# Altium project stm32-synthesizer.PrjPcb
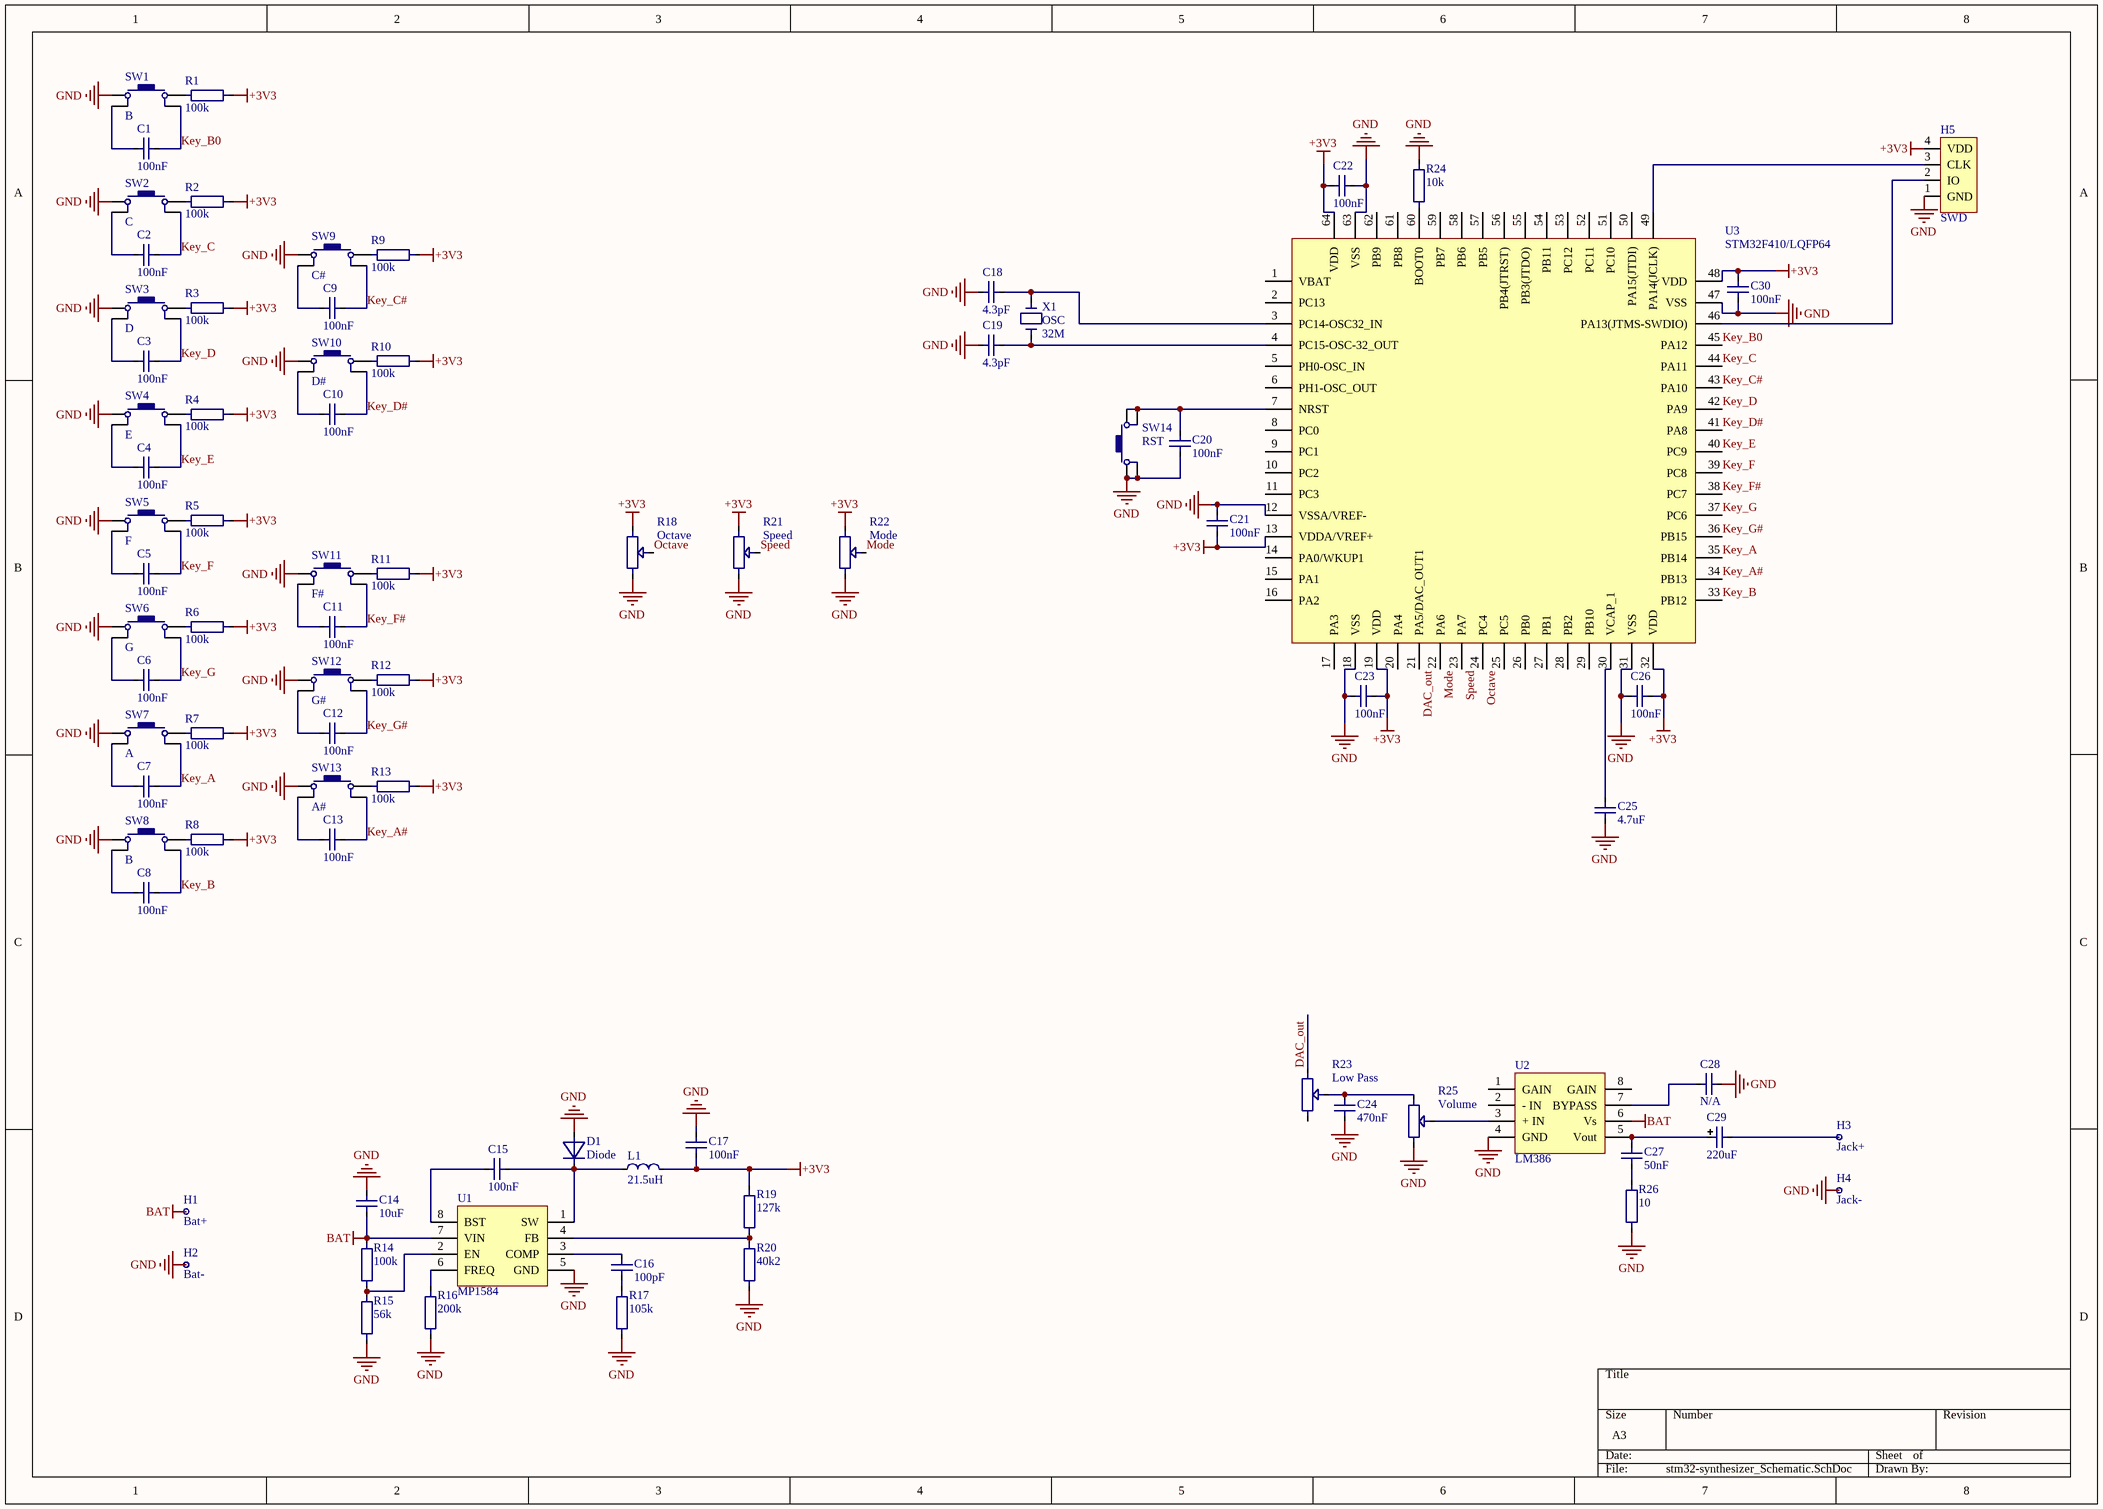
[diagram p0: stm32-synthesizer_Schematic.SchDoc]
1 sheet, 81 parts. Net scope: global (net labels, ports and power ports of the same name join across sheets).
Board file: stm32-synthesizer_Board.PcbDoc

## Sheet stm32-synthesizer_Schematic.SchDoc
size A3

### Parts
C1  100nF  [CRCW0805]
C2  100nF  [CRCW0805]
C3  100nF  [CRCW0805]
C4  100nF  [CRCW0805]
C5  100nF  [CRCW0805]
C6  100nF  [CRCW0805]
C7  100nF  [CRCW0805]
C8  100nF  [CRCW0805]
C9  100nF  [CRCW0805]
C10  100nF  [CRCW0805]
C11  100nF  [CRCW0805]
C12  100nF  [CRCW0805]
C13  100nF  [CRCW0805]
C14  10uF  [CRCW0805]
C15  100nF  [GRM188]
C16  100pF  [CRCW0805]
C17  100nF  [GRM188]
C18  4.3pF  [CRCW0805]
C19  4.3pF  [CRCW0805]
C20  100nF  [CRCW0805]
C21  100nF  [CRCW0805]
C22  100nF  [CRCW0805]
C23  100nF  [CRCW0805]
C24  470nF  [CRCW0805]
C25  4.7uF  [CRCW0805]
C26  100nF  [CRCW0805]
C27  50nF  [CRCW0805]
C28  N/A  [CRCW0805]
C29  220uF  [CAPAE6766X81M]
C30  100nF  [CRCW0805]
D1  Diode  [DIODES-INCORPORATED_1N5819]
H1  Bat+  [Hole 1mm]
H2  Bat-  [Hole 1mm]
H3  Jack+  [Hole 1mm]
H4  Jack-  [Hole 1mm]
H5  SWD  [M20-97704]
L1  21.5uH  [Coil 0.7mm d=7mm]
R1  100k  [CRCW0805]
R2  100k  [CRCW0805]
R3  100k  [CRCW0805]
R4  100k  [CRCW0805]
R5  100k  [CRCW0805]
R6  100k  [CRCW0805]
R7  100k  [CRCW0805]
R8  100k  [CRCW0805]
R9  100k  [CRCW0805]
R10  100k  [CRCW0805]
R11  100k  [CRCW0805]
R12  100k  [CRCW0805]
R13  100k  [CRCW0805]
R14  100k  [CRCW0805]
R15  56k  [CRCW0805]
R16  200k  [CRCW0805]
R17  105k  [CRCW0805]
R18  Octave  [RK09K113]
R19  127k  [CRCW0805]
R20  40k2  [CRCW0805]
R21  Speed  [RK09K113]
R22  Mode  [RK09K113]
R23  Low Pass  [RK09K113]
R24  10k  [CRCW0805]
R25  Volume  [RK09K113]
R26  10  [CRCW0805]
SW1  B  [TL1105]
SW2  C  [TL1105]
SW3  D  [TL1105]
SW4  E  [TL1105]
SW5  F  [TL1105]
SW6  G  [TL1105]
SW7  A  [TL1105]
SW8  B  [TL1105]
SW9  C#  [TL1105]
SW10  D#  [TL1105]
SW11  F#  [TL1105]
SW12  G#  [TL1105]
SW13  A#  [TL1105]
SW14  RST  [TL1105]
U1  MP1584  [SOIC127P600X175-8N]
U2  LM386  [LM358 SOIC]
U3  STM32F410/LQFP64  [STM32F410/LQFP64]
X1  OSC  Frequency: 32M  [SODFL1230X430-2N]

### Nets
+3V3: C17.1 C21.1 C22.1 C23.1 C26.1 C30.1 H5.4(VDD) L1.2 R1.2 R2.2 R3.2 R4.2 R5.2 R6.2 R7.2 R8.2 R9.2 R10.2 R11.2 R12.2 R13.2 R18.1 R19.2 R21.1 R22.1 U3.13(VDDA/VREF+) U3.19(VDD) U3.32(VDD) U3.48(VDD) U3.64(VDD)
BAT: C14.1 H1.1 R14.2 U1.7(VIN) U2.6(Vs)
GND: C14.2 C17.2 C18.2 C19.2 C20.1 C21.2 C22.2 C23.2 C24.1 C25.1 C26.2 C28.2 C30.2 D1.1 H2.1 H4.1 H5.1(GND) R15.1 R16.1 R17.1 R18.3 R20.1 R21.3 R22.3 R24.2 R25.3 R26.1 SW1.1 SW2.1 SW3.1 SW4.1 SW5.1 SW6.1 SW7.1 SW8.1 SW9.1 SW10.1 SW11.1 SW12.1 SW13.1 SW14.1 SW14.2 U1.5(GND) U2.4(GND) U3.12(VSSA/VREF-) U3.18(VSS) U3.31(VSS) U3.47(VSS) U3.63(VSS)
DAC_out: R23.1 U3.21(PA5/DAC_OUT1)
Key_A: C7.2 SW7.4 U3.35(PB14)
Key_A#: C13.2 SW13.4 U3.34(PB13)
Key_B: C8.2 SW8.4 U3.33(PB12)
Key_B0: C1.2 SW1.4 U3.45(PA12)
Key_C: C2.2 SW2.4 U3.44(PA11)
Key_C#: C9.2 SW9.4 U3.43(PA10)
Key_D: C3.2 SW3.4 U3.42(PA9)
Key_D#: C10.2 SW10.4 U3.41(PA8)
Key_E: C4.2 SW4.4 U3.40(PC9)
Key_F: C5.2 SW5.4 U3.39(PC8)
Key_F#: C11.2 SW11.4 U3.38(PC7)
Key_G: C6.2 SW6.4 U3.37(PC6)
Key_G#: C12.2 SW12.4 U3.36(PB15)
Mode: R22.2 U3.22(PA6)
Octave: R18.2 U3.24(PC4)
Speed: R21.2 U3.23(PA7)
NetC1_1: C1.1 SW1.2
NetC2_1: C2.1 SW2.2
NetC3_1: C3.1 SW3.2
NetC4_1: C4.1 SW4.2
NetC5_1: C5.1 SW5.2
NetC6_1: C6.1 SW6.2
NetC7_1: C7.1 SW7.2
NetC8_1: C8.1 SW8.2
NetC9_1: C9.1 SW9.2
NetC10_1: C10.1 SW10.2
NetC11_1: C11.1 SW11.2
NetC12_1: C12.1 SW12.2
NetC13_1: C13.1 SW13.2
NetC15_1: C15.1 U1.8(BST)
NetC15_2: C15.2 D1.2 L1.1 U1.1(SW)
NetC16_1: C16.1 R17.2
NetC16_2: C16.2 U1.3(COMP)
NetC18_1: C18.1 U3.3(PC14-OSC32_IN) X1.2
NetC19_1: C19.1 U3.4(PC15-OSC-32_OUT) X1.1
NetC20_2: C20.2 SW14.3 SW14.4 U3.7(NRST)
NetC24_2: C24.2 R23.2 R25.1
NetC25_2: C25.2 U3.30(VCAP_1)
NetC27_1: C27.1 C29.2 U2.5(Vout)
NetC27_2: C27.2 R26.2
NetC28_1: C28.1 U2.7(BYPASS)
NetC29_1: C29.1 H3.1
NetH5_2: H5.2(IO) U3.46(PA13(JTMS-SWDIO))
NetH5_3: H5.3(CLK) U3.49(PA14(JCLK))
NetR1_1: R1.1 SW1.3
NetR2_1: R2.1 SW2.3
NetR3_1: R3.1 SW3.3
NetR4_1: R4.1 SW4.3
NetR5_1: R5.1 SW5.3
NetR6_1: R6.1 SW6.3
NetR7_1: R7.1 SW7.3
NetR8_1: R8.1 SW8.3
NetR9_1: R9.1 SW9.3
NetR10_1: R10.1 SW10.3
NetR11_1: R11.1 SW11.3
NetR12_1: R12.1 SW12.3
NetR13_1: R13.1 SW13.3
NetR14_1: R14.1 R15.2 U1.2(EN)
NetR16_2: R16.2 U1.6(FREQ)
NetR19_1: R19.1 R20.2 U1.4(FB)
NetR24_1: R24.1 U3.60(BOOT0)
NetR25_2: R25.2 U2.3(+_IN)

Not connected (* = marked no-connect by the designer): R23 3; U2 1(GAIN) 2(-_IN) 8(GAIN); U3 1(VBAT) 2(PC13) 5(PH0-OSC_IN) 6(PH1-OSC_OUT) 8(PC0) 9(PC1) 10(PC2) 11(PC3) 14(PA0/WKUP1) 15(PA1) 16(PA2) 17(PA3) 20(PA4) 25(PC5) 26(PB0) 27(PB1) 28(PB2) 29(PB10) 50(PA15(JTDI)) 51(PC10) 52(PC11) 53(PC12) 54(PB11) 55(PB3(JTDO)) 56(PB4(JTRST)) 57(PB5) 58(PB6) 59(PB7) 61(PB8) 62(PB9)

### Library data of the parts
C1-C28 C30 = Capacitor
  C1-C13 C15 C17 C20-C23 C26 C30: Capacitance: 100nF
  C14: Capacitance: 10uF
  C16: Capacitance: 100pF
  C18 C19: Capacitance: 4.3pF
  C24: Capacitance: 470nF
  C25: Capacitance: 4.7uF
  C27: Capacitance: 50nF
  C28: Capacitance: N/A
C29 = Capacitor_Polarized: Capacitance: 220uF
H1-H4 = Cable Hole
H5 = Header4
L1 = Coil: Inductance: 21.5uH
R1-R17 R19 R20 R24 R26 = Resitor
  R1-R14: Resistance: 100k
  R15: Resistance: 56k
  R16: Resistance: 200k
  R17: Resistance: 105k
  R19: Resistance: 127k
  R20: Resistance: 40k2
  R24: Resistance: 10k
  R26: Resistance: 10
R18 R21-R23 R25 = Potentiometer: Resistance: 10k
SW1-SW14 = Button
U2 = LM386: Low Voltage Audio Power Amplifier
X1 = Oscillator